# EAGLE schematic Controller (EAGLE 9.6.2)

## Sheet 1 of 2
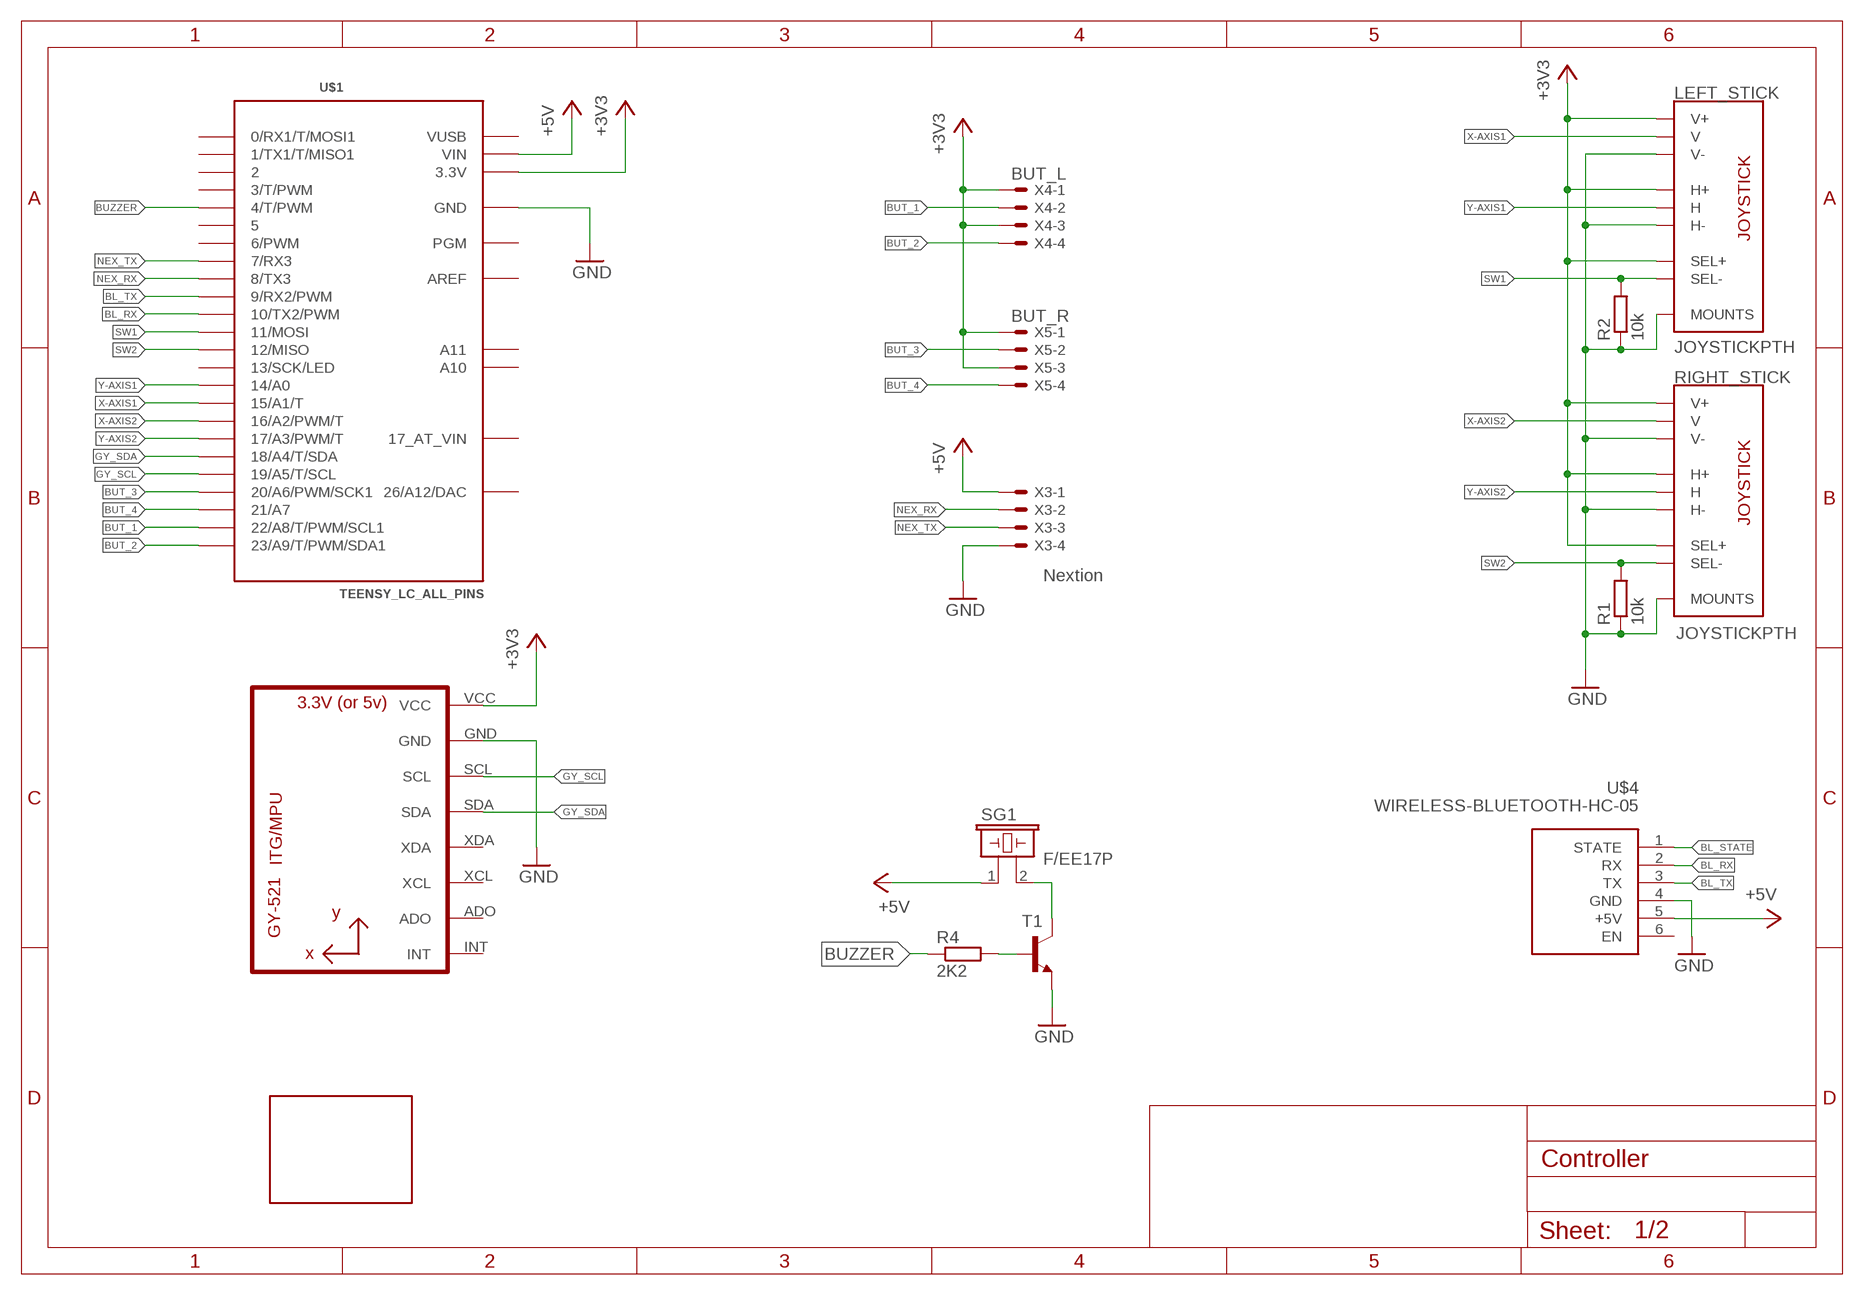
[diagram p0: schematic, sheet 1]

### Parts
LEFT_STICK  JOYSTICKPTH  [JOYSTICK]
R1  10k  R-EU_0207/10  [0207/10]
R2  10k  R-EU_0207/10  [0207/10]
R4  2K2  R-EU_0207/10  [0207/10]
RIGHT_STICK  JOYSTICKPTH  [JOYSTICK]
SG1  F/EE17P  [F/EE17P]
T1  -NPN-TO92-EBC  [TO92-EBC]
U1  GY-521MPU6050  [GY-521]
U$1  TEENSY_LC_ALL_PINS  [TEENSY_3.0-3.2&LC_ALL_PINS]
U$4  WIRELESS-BLUETOOTH-HC-05  [WIRELESS-BLUETOOTH-HC-05]
U$9  NX4832K035  [NX4832K035]
X3  Nextion  JST-XH-04-PIN-LONG-PAD  [JST-XH-04-PACKAGE-LONG-PAD]
X4  BUT_L  JST-XH-04-PIN-LONG-PAD  [JST-XH-04-PACKAGE-LONG-PAD]
X5  BUT_R  JST-XH-04-PIN-LONG-PAD  [JST-XH-04-PACKAGE-LONG-PAD]

### Nets
+3V3: LEFT_STICK.B1A(SEL+) LEFT_STICK.B1B(SEL+) LEFT_STICK.H1(H+) LEFT_STICK.V1(V+) RIGHT_STICK.B1A(SEL+) RIGHT_STICK.B1B(SEL+) RIGHT_STICK.H1(H+) RIGHT_STICK.V1(V+) U1.VCC U$1.3.3V U$1.3.3V1(3.3V) X4.1 X4.3 X5.1 X5.3
+5V: SG1.1 U$1.VIN U$4.5(+5V) X3.1 ; also sheet 2
BL_RX: U$1.10(10/TX2/PWM) U$4.2(RX)
BL_STATE: U$4.1(STATE)
BL_TX: U$1.9(9/RX2/PWM) U$4.3(TX)
BUT_1: U$1.22/A8(22/A8/T/PWM/SCL1) X4.2
BUT_2: U$1.23/A9(23/A9/T/PWM/SDA1) X4.4
BUT_3: U$1.20/A6(20/A6/PWM/SCK1) X5.2
BUT_4: U$1.21/A7 X5.4
BUZZER: R4.1 U$1.4(4/T/PWM)
GND: LEFT_STICK.H3(H-) LEFT_STICK.MOUNT1(MOUNTS) LEFT_STICK.MOUNT2(MOUNTS) LEFT_STICK.MOUNT3(MOUNTS) LEFT_STICK.MOUNT4(MOUNTS) LEFT_STICK.V3(V-) R1.1 R2.1 RIGHT_STICK.H3(H-) RIGHT_STICK.MOUNT1(MOUNTS) RIGHT_STICK.MOUNT2(MOUNTS) RIGHT_STICK.MOUNT3(MOUNTS) RIGHT_STICK.MOUNT4(MOUNTS) RIGHT_STICK.V3(V-) T1.E U1.GND U$1.AGND(GND) U$1.GND U$1.GND1(GND) U$4.4(GND) X3.4 ; also sheet 2
GY_SCL: U1.SCL U$1.19/A5(19/A5/T/SCL)
GY_SDA: U1.SDA U$1.18/A4(18/A4/T/SDA)
N$7: R4.2 T1.B
N$8: SG1.2 T1.C
NEX_RX: U$1.8(8/TX3) X3.2
NEX_TX: U$1.7(7/RX3) X3.3
SW1: LEFT_STICK.B2A(SEL-) LEFT_STICK.B2B(SEL-) R2.2 U$1.11(11/MOSI)
SW2: R1.2 RIGHT_STICK.B2A(SEL-) RIGHT_STICK.B2B(SEL-) U$1.12(12/MISO)
X-AXIS1: LEFT_STICK.V2(V) U$1.15/A1(15/A1/T)
X-AXIS2: RIGHT_STICK.V2(V) U$1.16/A2(16/A2/PWM/T)
Y-AXIS1: LEFT_STICK.H2(H) U$1.14/A0
Y-AXIS2: RIGHT_STICK.H2(H) U$1.17/A3(17/A3/PWM/T)
Unconnected: U1.ADO U1.INT U1.XCL U1.XDA U$1.0(0/RX1/T/MOSI1) U$1.1(1/TX1/T/MISO1) U$1.2 U$1.3(3/T/PWM) U$1.5 U$1.6(6/PWM) U$1.13(13/SCK/LED) U$1.A10 U$1.A11 U$1.PGM U$1.VBAT(17_AT_VIN) U$4.6(EN)

## Sheet 2 of 2
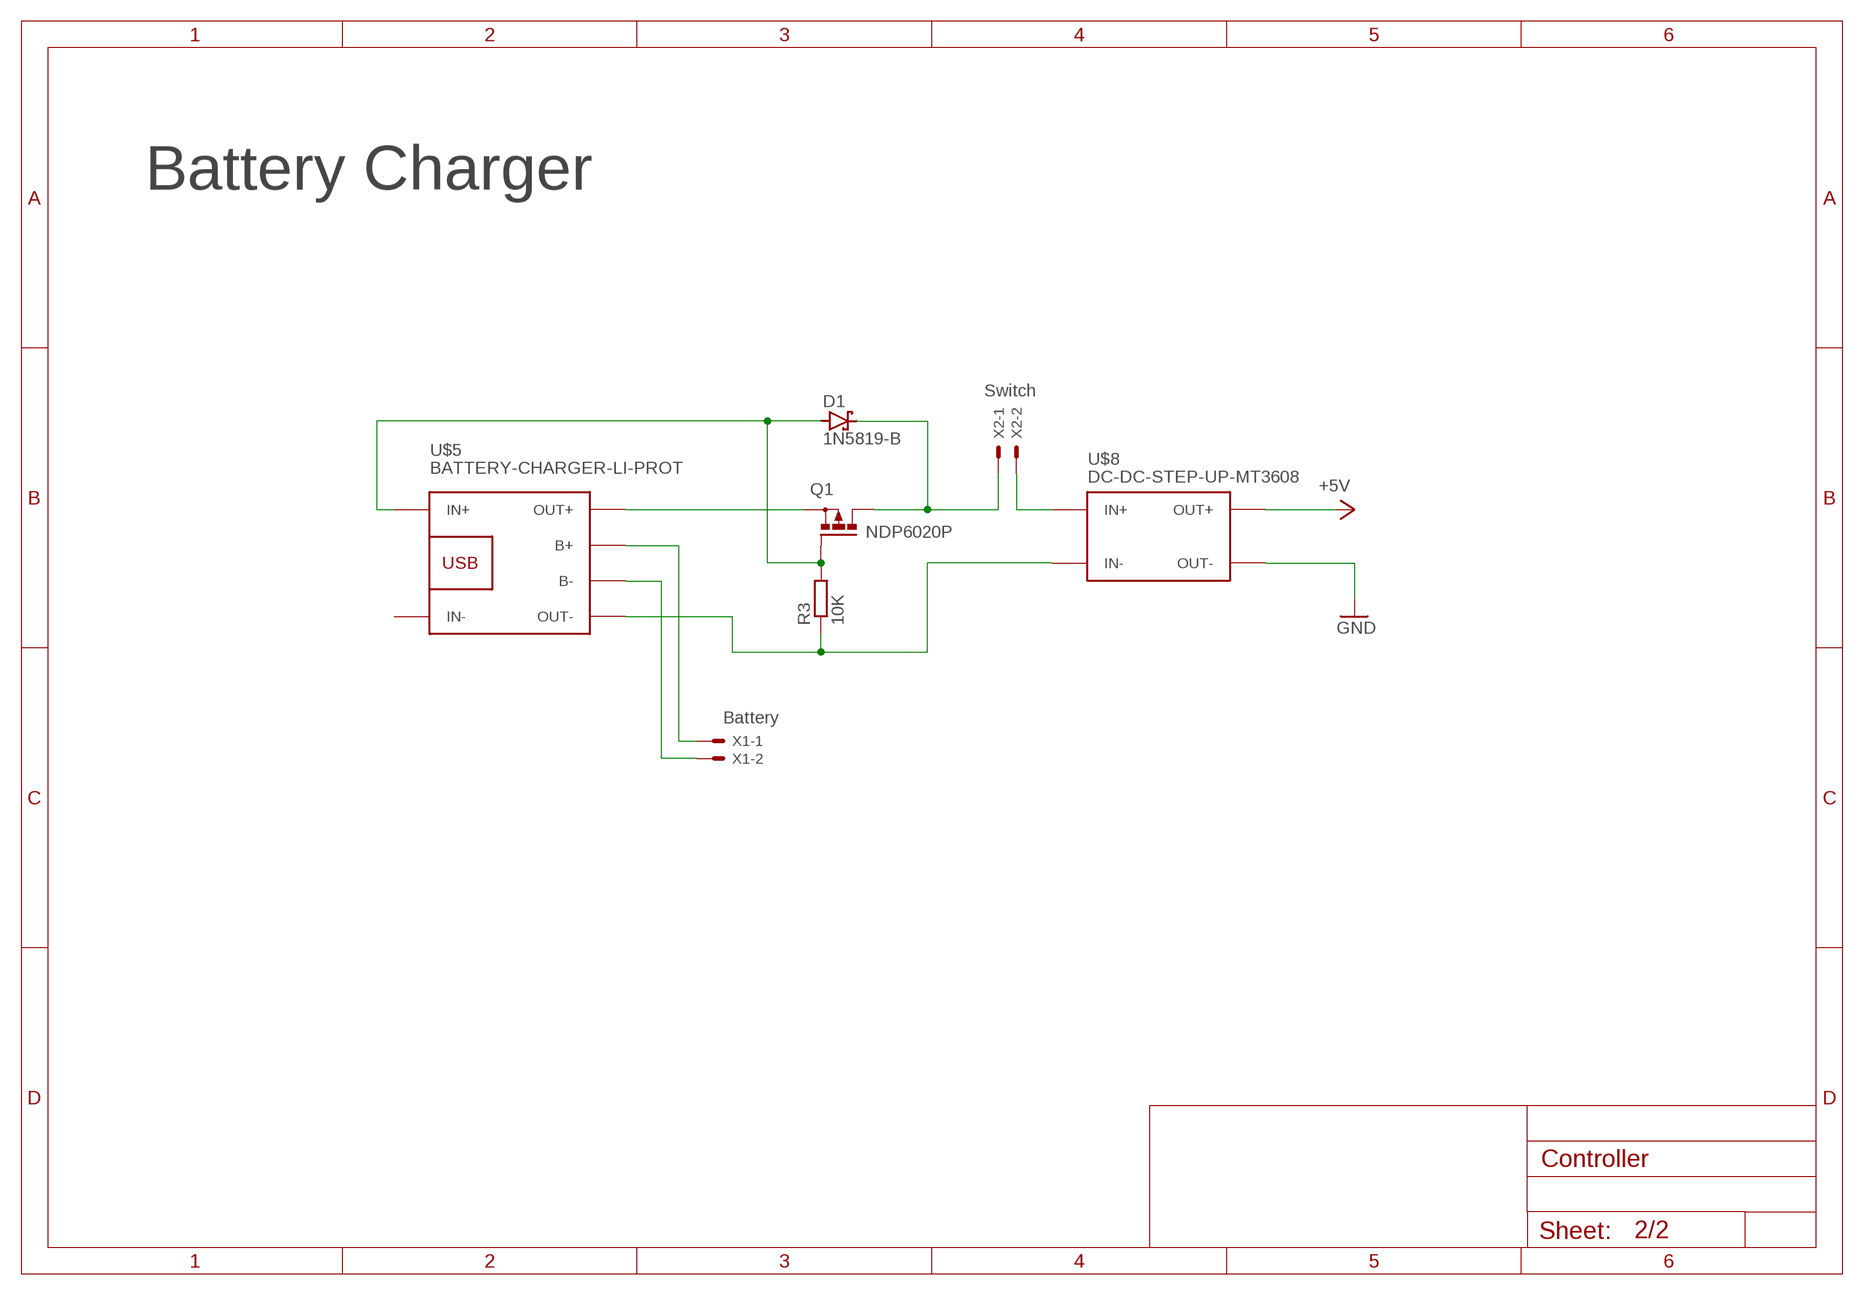
[diagram p1: schematic, sheet 2]

### Parts
D1  1N5819-B  [DO41-7.6]
Q1  NDP6020P  PMOSFET_PTO220BH  [TO220BH]
R3  10K  R-EU_0207/10  [0207/10]
U$5  BATTERY-CHARGER-LI-PROT  [BATTERY-CHARGER-LI-PROT]
U$8  DC-DC-STEP-UP-MT3608  [DC-DC-STEP-UP-MT3608]
X1  Battery  JST-XH-02-PIN-LONG-PAD  [JST-XH-02-PACKAGE-LONG-PAD]
X2  Switch  JST-XH-02-PIN-LONG-PAD  [JST-XH-02-PACKAGE-LONG-PAD]

### Nets
+5V: U$8.OUT+ ; also sheet 1
GND: U$8.OUT- ; also sheet 1
N$1: R3.1 U$5.OUT- U$8.IN-
N$2: U$5.B+ X1.1
N$3: U$5.B- X1.2
N$4: D1.C Q1.D X2.1
N$5: Q1.S U$5.OUT+
N$6: U$8.IN+ X2.2
N$9: D1.A Q1.G R3.2 U$5.IN+
Unconnected: U$5.IN-

### Notes on the sheet
- Battery Charger

## Power pins joined to a net without a drawn wire
26/A12/DAC: U$1.RESET/DAC(26/A12/DAC)
AREF: U$1.AREF
VUSB: U$1.VUSB

## Library data of the parts
D1 = diode:1N581*: 1.0A SCHOTTKY BARRIER RECTIFIER Source: http://www.diodes.com/datasheets/ds23001.pdf
LEFT_STICK RIGHT_STICK = adafruit:JOYSTICK: Thumb Joystick Joystick commonly found in PS2 controllers. Two pots and a select switch. Adapted from Sparkfun Library (but for more common 6mm switch sticks); SPICEPREFIX: X
Q1 = transistor-power:PMOSFET_P: Power MOSFET P-Channel
R1-R4 = rcl:R-EU_: RESISTOR, European symbol; SPICEPREFIX: R
SG1 = buzzer:F/EE17P: BUZZER Source: Buerklin; OC_FARNELL: unknown; OC_NEWARK: unknown
T1 = transistor:*-NPN-: NPN Transistror BF959 corrected 2008.03.06
U1 = gy-521:GY-521
U$1 = Teensy_3_and_LC_Series_Boards_v1.4:TEENSY_LC_ALL_PINS: Teensy LC board with all pins used.
U$4 = TP4056:WIRELESS-BLUETOOTH-HC-05: Bluetooth Transceiver Module based on HC-05 board Tutorial is available here: https://arduino-info.wikispaces.com/BlueTooth-HC05-HC06-Modules-How-To Click here to find device on ebay.com <http://www.ebay.com/sch/hc-05+module+rs232>
U$5 = TP4056:BATTERY-CHARGER-LI-PROT: Lithium Battery 5V Charger with protection circuit More details available here: http://www.instructables.com/id/DIY-Lithium-ion-Battery-Charger/step4/TP4056-based-lithium-ion-battery-charger-module/ Click here to find device on ebay.com <http://www.ebay.com/sch/tp4056+charger+usb+protection>
U$8 = TP4056:DC-DC-STEP-UP-MT3608: DC/DC Step-Up Regulator based on MT3608 chip MT3608 datasheet available here: https://www.olimex.com/Products/Breadboarding/BB-PWR-3608/resources/MT3608.pdf Click here to find device on ebay.com <http://www.ebay.com/sch/mt3608+module>
U$9 = Nextion:NX4832K035
X1 X2 = Rembrandt Electronics - JST XH Connectors v1-0:JST-XH-02-PIN: JST XH Connector 2 Pin Wire to board connector. Pitch: 2,54 mm, (0.100") Number of pins: 2 Created by Rembrandt Electronics www.rembrandtelectronics.com
X3-X5 = Rembrandt Electronics - JST XH Connectors v1-0:JST-XH-04-PIN: JST XH Connector 2 Pin Wire to board connector. Pitch: 2,54 mm, (0.100") Number of pins: 4 Created by Rembrandt Electronics www.rembrandtelectronics.com